# Altium project CRD25DA12N-FMC V2 (09-2024).PrjPcb (part 4 of 9)
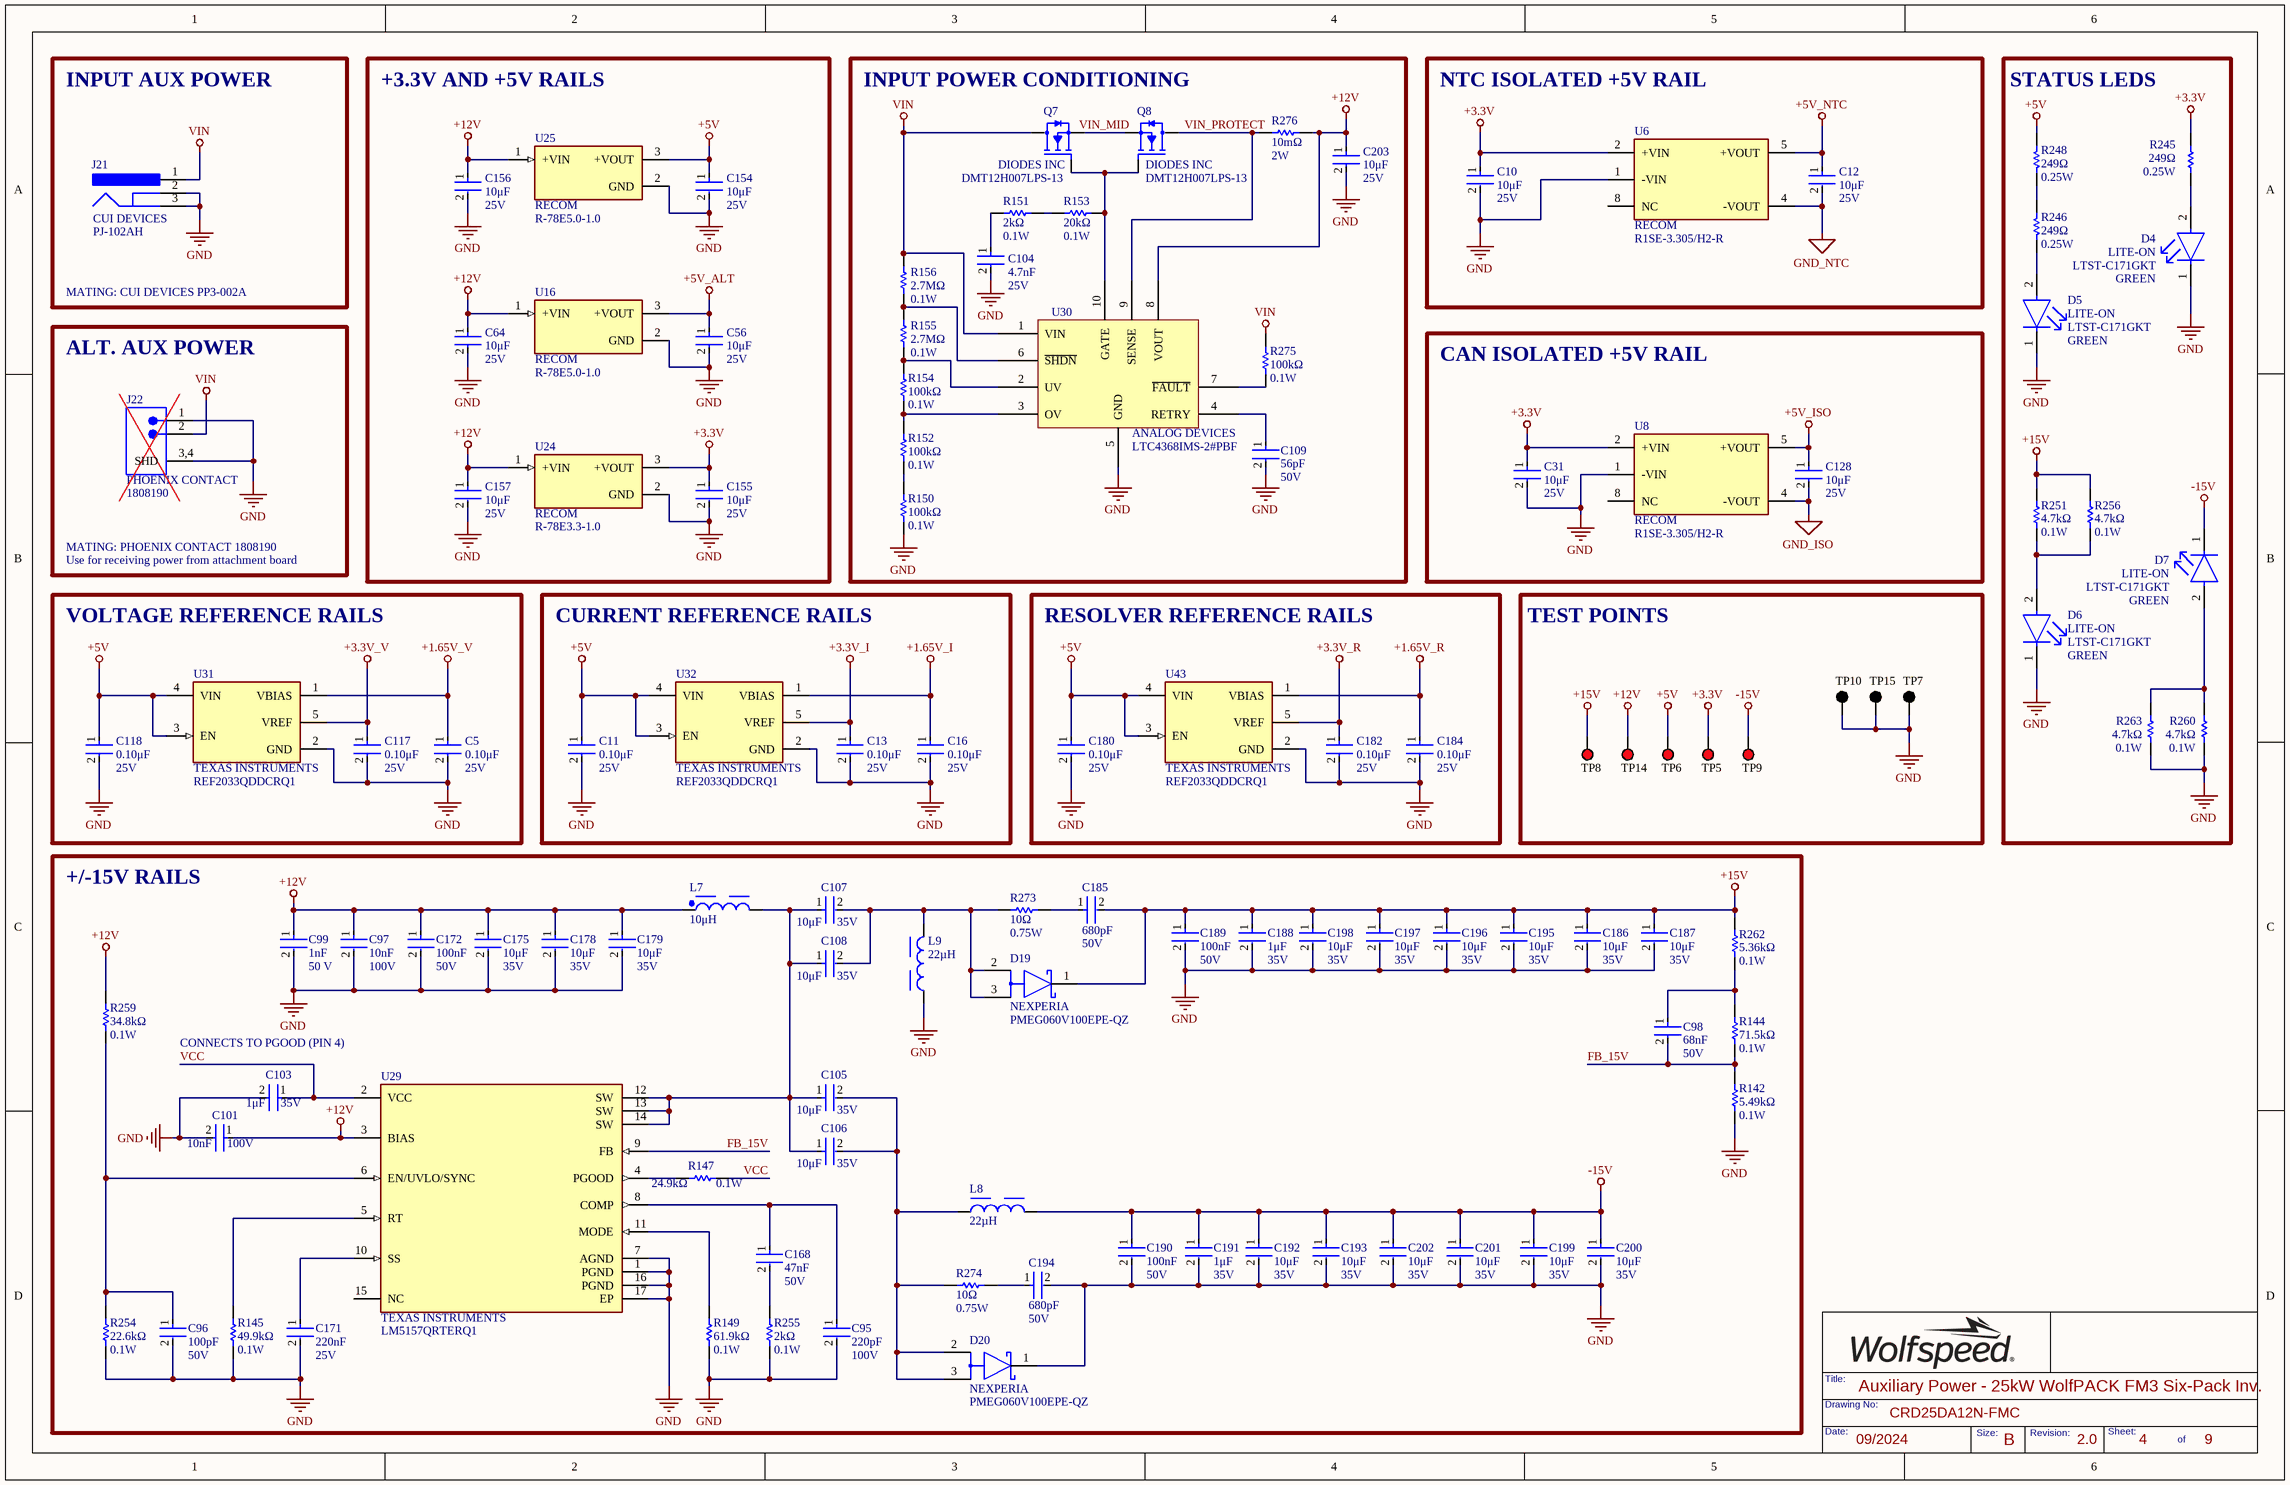
[diagram p10: 04 - Auxiliary Power.SchDoc]

## Sheet 04 - Auxiliary Power.SchDoc: Auxiliary Power - 25kW WolfPACK FM3 Six-Pack Inv. (continued)
### Library data of the parts
C5 C11 C13 C16 C117 C118 C180 C182 C184 = CMP-2006-03057-2: CAP CER 0.1UF 25V X7R 0603; Manufacturer: KEMET; Value: 0.10μF; Material: Ceramic; Tolerance: 0.1; Temperature Coefficient: 30ppm/°C; Automotive Grade: Grade 1; Lead Free: Yes; Device Class L3: Ceramic Capacitors; Manufacturer Part Number: C0603C104K3RACTU; Digikey Description: CAP CER 0.1UF 25V X7R 0603; Mouser Description: Multilayer Ceramic Capacitors MLCC - SMD/SMT 25volts 0.1uF X7R 10%; Package: 0603; Temperature Range Low: -55°C; Automotive: Yes; Device Class L2: Capacitors; Octopart: https://octopart.com/c0603c104k3ractu-kemet-127541; ComponentLink2Description: Datasheet; ComponentLink2URL: https://api.kemet.com/component-edge/download/datasheet/C0603C100J5GACAUTO.pdf; Temperature Range High: +125°C; RoHS: TRUE; Device Class L1: Passive Components; Category: Cap; Temperature: -55°C to +125°C; Height: 0.87mm; Temperature Characteristic: X7R
C10 C12 C31 C56 C64 C128 C154-C157 C203 = CMP-13271-001434-1: CAP CER 10UF 25V X7R 1206; Manufacturer: SAMSUNG; Tolerance: 10%; Value: 10μF; Max Operating Temperature: 125°C; Dielectric: X7R; Min Operating Temperature: -55°C; Height: 1.6mm; Mount: Surface Mount; Width: 0.063inch; Thickness: 0.071inch; Case Code (Metric): 3216; Contact Plating: Tin; Packaging: Tape and Reel; Package: 1206; Case Code (Imperial): 1206; Length: 0.126inch; Radiation Hardening: No; Package Quantity: 1; Depth: 1.6mm; Manufacturer Part Number: CL31B106KAHSFNE
C95 = GCM1885C2A221JA16D: CAP CER 220PF 100V C0G/NP0 0603; Manufacturer: MURATA; Material: 4241ConductorMaterial; Tolerance: 5%; Dielectric: C0G; Dissipation Factor: 0.01%; Temperature Coefficient: 30ppm/°C; Supplier 1: Mouser; Manufacturer Part Number: GCM1885C2A221JA16D; RoHS: Yes; Category: Ceramic Capacitors; Stock 1: 78175; Pricing 1: 1=0.11, 10=0.052, 50=0.052, 100=0.031, 1000=0.023, 10000=0.018 (USD); Mount: Surface Mount; Case/Package: 0603; Case Code (Metric): 1608; Case Code (Imperial): 0603; Min Operating Temperature: -55°C; Max Operating Temperature: 125°C; Capacitance: 220pF; Package Quantity: 1; Packaging: Tape and Reel; Voltage Rating (DC): 100V; Termination: SMD/SMT; Voltage: 100V; Series: GCM; Construction: Flat; Length: 1.6mm; Width: 0.031inch; Height: 0.8mm; Thickness: 0.035inch; Depth: 0.8mm; Ratings: AEC-Q200; Radiation Hardening: No; Lead Free: Lead Free; RoHS Compliant: Yes; ComponentLink1URL: https://datasheet.ciiva.com/133/product-133699.pdf?src-supplier=Digikey; ComponentLink1Description: https://datasheet.ciiva.com/133/product-133699.pdf?src-supplier=Digikey; ComponentLink2URL: https://datasheet.ciiva.com/133/product-133700.pdf?src-supplier=Digikey; ComponentLink2Description: https://datasheet.ciiva.com/133/product-133700.pdf?src-supplier=Digikey; ComponentLink3URL: https://datasheet.ciiva.com/133/product-133701.pdf?src-supplier=Digikey; ComponentLink3Description: https://datasheet.ciiva.com/133/product-133701.pdf?src-supplier=Digikey; ComponentLink4URL: https://datasheet.ciiva.com/11605/product-11605111.pdf?src-supplier=Avnet; ComponentLink4Description: https://datasheet.ciiva.com/11605/product-11605111.pdf?src-supplier=Avnet; ComponentLink5URL: https://datasheet.ciiva.com/16508/s0717e-16508220.pdf?src-supplier=Future+Electronics; ComponentLink5Description: https://datasheet.ciiva.com/16508/s0717e-16508220.pdf?src-supplier=Future+Electronics; Supplier Part Number 1: 81-GCM1885C2A221J16D; Package: 0603
C96 = CL10C101JB8NNNC: CAP CER 100PF 50V C0G/NP0 0603; Manufacturer: SAMSUNG; Material: Ceramic; Tolerance: 5%; Dielectric: C0G; Temperature Coefficient: 300ppm/°C; Supplier 1: Rs; Manufacturer Part Number: CL10C101JB8NNNC; RoHS: Yes; Category: Ceramic Capacitors; Stock 1: 488000; Mount: Surface Mount; Case Code (Metric): 1608; Case Code (Imperial): 0603; Contact Plating: Tin; Min Operating Temperature: -55°C; Max Operating Temperature: 125°C; Voltage Rating (DC): 50V; Packaging: Tape and Reel; Package Quantity: 1; Voltage Rating: 50V; Series: CL; Construction: Flat; Length: 1.6mm; Width: 0.031inch; Height: 0.8mm; Depth: 0.8mm; Thickness: 0.035inch; Radiation Hardening: No; Lead Free: Lead Free; RoHS Compliant: Yes; ComponentLink1URL: https://datasheet.ciiva.com/25782/cl10c101jb8nnnc-25782145.pdf?src-supplier=Digi-Key; ComponentLink1Description: https://datasheet.ciiva.com/25782/cl10c101jb8nnnc-25782145.pdf?src-supplier=Digi-Key; ComponentLink2URL: https://datasheet.ciiva.com/26838/getdatasheetpartid-358356-26838483.pdf?src-supplier=Verical; ComponentLink2Description: https://datasheet.ciiva.com/26838/getdatasheetpartid-358356-26838483.pdf?src-supplier=Verical; ComponentLink3URL: https://datasheet.ciiva.com/29199/456574-da-01-en-vs-kondensator-0603-29199002.pdf?src-supplier=Conrad; ComponentLink3Description: https://datasheet.ciiva.com/29199/456574-da-01-en-vs-kondensator-0603-29199002.pdf?src-supplier=Conrad; ComponentLink4URL: https://datasheet.ciiva.com/26310/mlcc-catalogdownload2013-eng-26310303.pdf?src-supplier=Distrelec; ComponentLink4Description: https://datasheet.ciiva.com/26310/mlcc-catalogdownload2013-eng-26310303.pdf?src-supplier=Distrelec; Supplier Part Number 1: 7665130; Package: 0603; Value: 100pF
C97 C101 = GCM188R72A103KA37D: CAP CER 10000PF 100V X7R 0603; Manufacturer: MURATA; Material: 4241ConductorMaterial; Tolerance: 10%; Supplier 1: Mouser; Manufacturer Part Number: GCM188R72A103KA37D; RoHS: Yes; Category: Ceramic Capacitors; Stock 1: 588517; Pricing 1: 1=0.1, 10=0.037, 50=0.037, 100=0.019, 1000=0.012, 4000=0.011, 8000=0.009, 10000=0.009, 24000=0.008, 100000=0.007 (USD); Mount: Surface Mount; Case/Package: 0603; Case Code (Imperial): 0603; Case Code (Metric): 1608; Min Operating Temperature: -55°C; Max Operating Temperature: 125°C; Capacitance: 10nF; Packaging: Tape and Reel; Voltage Rating (DC): 100V; Package Quantity: 1; Dielectric: X7R; Termination: SMD/SMT; Voltage: 100V; Series: GCM; Construction: Flat; Length: 1.6mm; Width: 0.031inch; Height: 0.8mm; Thickness: 0.035inch; Depth: 0.8mm; Ratings: AEC-Q200; Radiation Hardening: No; Reach SVHC Compliant: No; Lead Free: Lead Free; RoHS Compliant: Yes; ComponentLink1URL: https://datasheet.ciiva.com/132/product-132908.pdf?src-supplier=Digikey; ComponentLink1Description: https://datasheet.ciiva.com/132/product-132908.pdf?src-supplier=Digikey; ComponentLink2URL: https://datasheet.ciiva.com/132/product-132907.pdf?src-supplier=Digikey; ComponentLink2Description: https://datasheet.ciiva.com/132/product-132907.pdf?src-supplier=Digikey; ComponentLink3URL: https://datasheet.ciiva.com/132/product-132909.pdf?src-supplier=Digikey; ComponentLink3Description: https://datasheet.ciiva.com/132/product-132909.pdf?src-supplier=Digikey; ComponentLink4URL: https://datasheet.ciiva.com/11786/0900766b80ef92d0-11786108.pdf?src-supplier=Rs; ComponentLink4Description: https://datasheet.ciiva.com/11786/0900766b80ef92d0-11786108.pdf?src-supplier=Rs; ComponentLink5URL: https://datasheet.ciiva.com/16497/product-16497251.pdf?src-supplier=Future+Electronics; ComponentLink5Description: https://datasheet.ciiva.com/16497/product-16497251.pdf?src-supplier=Future+Electronics; ComponentLink6URL: https://datasheet.ciiva.com/18183/getdatasheetpartid-178890-18183651.pdf?src-supplier=Verical; ComponentLink6Description: https://datasheet.ciiva.com/18183/getdatasheetpartid-178890-18183651.pdf?src-supplier=Verical; ComponentLink7URL: https://datasheet.ciiva.com/11619/product-11619719.pdf?src-supplier=Avnet; ComponentLink7Description: https://datasheet.ciiva.com/11619/product-11619719.pdf?src-supplier=Avnet; Supplier Part Number 1: 81-GCM188R72A103KA7D; Package: 0603
C98 = CGA3E2X7R1H683K080AA: CAP CER 0.068UF 50V X7R 0603; Manufacturer: TDK; Tolerance: 10%; Supplier 1: Digikey; Manufacturer Part Number: CGA3E2X7R1H683K080AA; RoHS: Yes; Category: Ceramic Capacitors; Stock 1: 167422; Pricing 1: 1=0.11, 10=0.075, 50=0.0432, 100=0.0335, 500=0.02524, 1000=0.01983 (USD); Mount: Surface Mount; Case/Package: 0603; Case Code (Metric): 1608; Case Code (Imperial): 0603; Weight: 7.1E-05oz; Min Operating Temperature: -55°C; Max Operating Temperature: 125°C; Packaging: Tape and Reel; Capacitance: 68nF; Voltage Rating: 50V; Termination: SMD/SMT; Series: CGA; Package Quantity: 4000; Dielectric: X7R; Length: 1.6mm; Width: 0.8mm; Height: 0.8mm; Depth: 0.8mm; Ratings: AEC-Q200; RoHS Compliant: Yes; Reach SVHC Compliant: No; ComponentLink1URL: https://datasheet.ciiva.com/24219/cga3e2x7r1h683k080aa-265937-24219113.pdf?src-supplier=Mouser; ComponentLink1Description: https://datasheet.ciiva.com/24219/cga3e2x7r1h683k080aa-265937-24219113.pdf?src-supplier=Mouser; ComponentLink2URL: https://datasheet.ciiva.com/46424/1839935-46424229.pdf?src-supplier=Element14; ComponentLink2Description: https://datasheet.ciiva.com/46424/1839935-46424229.pdf?src-supplier=Element14; ComponentLink3URL: https://datasheet.ciiva.com/46424/1839935-46424230.pdf?src-supplier=Element14; ComponentLink3Description: https://datasheet.ciiva.com/46424/1839935-46424230.pdf?src-supplier=Element14; Supplier Part Number 1: 445-5665-1-ND; Package: 0603
C99 = CMP-2006-03716-2: CAP CER 1000PF 50V X7R 0603; Manufacturer: KEMET; Material: Ceramic; Automotive Grade: Grade 1; Value: 1nF; Tolerance: 0.1; Temperature Coefficient: 30ppm/°C; Category: Cap; Automotive: Yes; Temperature Range High: +125°C; Temperature Range Low: -55°C; Temperature Characteristic: X7R; Device Class L1: Passive Components; Height: 0.87mm; Lead Free: Yes; Package: 0603; Digikey Description: CAP CER 1000PF 50V X7R 0603; Manufacturer Part Number: C0603C102K5RACAUTO; ComponentLink2URL: https://api.kemet.com/component-edge/download/datasheet/C0603C100J5GACAUTO.pdf; Mouser Description: Multilayer Ceramic Capacitors MLCC - SMD/SMT 1000pF 50volts 10% X7R AUTO; RoHS: TRUE; Octopart: https://octopart.com/c0603c102k5racauto-kemet-18822673; Device Class L3: Ceramic Capacitors; ComponentLink2Description: Datasheet; Device Class L2: Capacitors; Temperature: -55°C to +125°C
C103 C188 C191 = CGA3E1X7R1V105K080AC: CAP CER 1UF 35V X7R 0603; Manufacturer: TDK; Material: 4241ConductorMaterial; Tolerance: 10%; Supplier 1: Avnet; Manufacturer Part Number: CGA3E1X7R1V105K080AC; RoHS: Yes; Category: Ceramic Capacitors; Stock 1: 4000; Pricing 1: 4000=0.042, 8000=0.04, 24000=0.039 (USD); Mount: Surface Mount; Case/Package: 0603; Case Code (Metric): 1608; Case Code (Imperial): 0603; Weight: 7.1E-05oz; Min Operating Temperature: -55°C; Max Operating Temperature: 125°C; Capacitance: 1μF; Packaging: Tape and Reel; Dielectric: X7R; Termination: SMD/SMT; Voltage Rating (DC): 35V; Package Quantity: 4000; Series: CGA; Length: 1.6mm; Width: 0.8mm; Height: 0.8mm; Ratings: AEC-Q200; RoHS Compliant: Yes; ComponentLink1URL: https://4donline.ihs.com/images/VipMasterIC/IC/TDKC/TDKC-S-A0003616427/TDKC-S-A0003616427-1.pdf?hkey=52A5661711E402568146F3353EA87419&src-supplier=Farnell; ComponentLink1Description: https://4donline.ihs.com/images/VipMasterIC/IC/TDKC/TDKC-S-A0003616427/TDKC-S-A0003616427-1.pdf?hkey=52A5661711E402568146F3353EA87419&src-supplier=Farnell; ComponentLink2URL: https://datasheet.octopart.com/CGA3E1X7R1V105K080AC-TDK-datasheet-136412745.pdf?src-supplier=Element14; ComponentLink2Description: https://datasheet.octopart.com/CGA3E1X7R1V105K080AC-TDK-datasheet-136412745.pdf?src-supplier=Element14; ComponentLink3URL: https://datasheet.octopart.com/CGA3E1X7R1V105K080AC-TDK-datasheet-43366117.pdf?src-supplier=Future+Electronics; ComponentLink3Description: https://datasheet.octopart.com/CGA3E1X7R1V105K080AC-TDK-datasheet-43366117.pdf?src-supplier=Future+Electronics; ComponentLink4URL: https://product.tdk.com/info/en/catalog/datasheets/mlcc_automotive_general_en.pdf?src-supplier=Digikey; ComponentLink4Description: https://product.tdk.com/info/en/catalog/datasheets/mlcc_automotive_general_en.pdf?src-supplier=Digikey; ComponentLink5URL: https://4donline.ihs.com/images/VipMasterIC/IC/TDKC/TDKC-S-A0003616427/TDKC-S-A0003616427-1.pdf?hkey=52A5661711E402568146F3353EA87419&src-supplier=Newark; ComponentLink5Description: https://4donline.ihs.com/images/VipMasterIC/IC/TDKC/TDKC-S-A0003616427/TDKC-S-A0003616427-1.pdf?hkey=52A5661711E402568146F3353EA87419&src-supplier=Newark; ComponentLink6URL: http://product.tdk.com/capacitor/mlcc/detailed_information.php?lang=en&ref=jp&part_no=CGA3E1X7R1V105K080AC&src-supplier=Mouser; ComponentLink6Description: http://product.tdk.com/capacitor/mlcc/detailed_information.php?lang=en&ref=jp&part_no=CGA3E1X7R1V105K080AC&src-supplier=Mouser; ComponentLink7URL: http://product.tdk.com/capacitor/mlcc/class/print_detail_pdf.php?lang=en&part_no=CGA3E1X7R1V105K080AC&src-supplier=Avnet; ComponentLink7Description: http://product.tdk.com/capacitor/mlcc/class/print_detail_pdf.php?lang=en&part_no=CGA3E1X7R1V105K080AC&src-supplier=Avnet; Supplier Part Number 1: 68AH9307; Package: 0603
C104 = C0603C472K3RAC7867: CAP CER 4700PF 25V 10% X7R 0603; Manufacturer: KEMET; Manufacturer Part Number: C0603C472K3RACTU; Dielectric Material: Ceramic; Value: 4.7nF; Supplier 1: Newark; RoHS: Yes; Category: Ceramic Capacitors; Stock 1: 8000; Pricing 1: 1=0.04800, 4000=0.04800 (USD); Mount: Surface Mount; Package: 0603; Case Code (Metric): 1608; Case Code (Imperial): 0603; Min Operating Temperature: -55°C; Max Operating Temperature: 125°C; Tolerance: 10%; Dielectric: X7R; Packaging: Tape and Reel; Package Quantity: 1; Voltage Rating (DC): 25V; Termination: SMD/SMT; Dissipation Factor: 10%; Series: C; Construction: Flat; Length: 1.6mm; Width: 0.031inch; Height: 0.8mm; Thickness: 0.034inch; Lead Pitch: 0.7mm; Depth: 0.8mm; Radiation Hardening: No; Reach SVHC Compliant: Yes; RoHS Compliant: Yes; ComponentLink1URL: https://datasheet.ciiva.com/5414/kem-c1002-x7r-smd-357932-5414293.pdf?src-supplier=Mouser; ComponentLink1Description: https://datasheet.ciiva.com/5414/kem-c1002-x7r-smd-357932-5414293.pdf?src-supplier=Mouser; Supplier Part Number 1: 67AH9250
C105-C108 C175 C178 C179 C186 C187 C192 C193 C195-C202 = GRM188R6YA106MA73D: CAP CER 10UF 35V X5R 0603; Manufacturer: MURATA; Material: 4241ConductorMaterial; Tolerance: 20%; Supplier 1: Mouser; Manufacturer Part Number: GRM188R6YA106MA73D; RoHS: Yes; Category: Ceramic Capacitors; Stock 1: 250689; Pricing 1: 1=0.31, 10=0.165, 50=0.165, 100=0.099, 1000=0.076, 4000=0.067, 8000=0.06, 10000=0.06, 24000=0.058, 100000=0.049 (USD); Mount: Surface Mount; Case/Package: 0603; Case Code (Metric): 1608; Case Code (Imperial): 0603; Min Operating Temperature: -55°C; Max Operating Temperature: 85°C; Packaging: Cut Tape; Capacitance: 10μF; Voltage Rating (DC): 35V; Dielectric: X5R; Series: GRM; Length: 0.063inch; Width: 0.031inch; Height: 1mm; Thickness: 0.039inch; RoHS Compliant: Yes; ComponentLink1URL: https://datasheet.octopart.com/GRM188R6YA106MA73D-Murata-datasheet-149523261.pdf?src-supplier=Newark; ComponentLink1Description: https://datasheet.octopart.com/GRM188R6YA106MA73D-Murata-datasheet-149523261.pdf?src-supplier=Newark; ComponentLink2URL: http://search.murata.co.jp/Ceramy/image/img/A01X/G101/ENG/GRM188R6YA106MA73-01.pdf?src-supplier=Future+Electronics; ComponentLink2Description: http://search.murata.co.jp/Ceramy/image/img/A01X/G101/ENG/GRM188R6YA106MA73-01.pdf?src-supplier=Future+Electronics; ComponentLink3URL: http://search.murata.co.jp/Ceramy/image/img/A01X/G101/ENG/GRM188R6YA106MA73-01.pdf?src-supplier=Digikey; ComponentLink3Description: http://search.murata.co.jp/Ceramy/image/img/A01X/G101/ENG/GRM188R6YA106MA73-01.pdf?src-supplier=Digikey; ComponentLink4URL: https://www.murata.com/~/media/webrenewal/support/library/catalog/products/capacitor/mlcc/c02e.ashx?la=en-us&src-supplier=Digikey; ComponentLink4Description: https://www.murata.com/~/media/webrenewal/support/library/catalog/products/capacitor/mlcc/c02e.ashx?la=en-us&src-supplier=Digikey; ComponentLink5URL: https://datasheet.octopart.com/GRM188R6YA106MA73D-Murata-datasheet-86813743.pdf?src-supplier=Future+Electronics; ComponentLink5Description: https://datasheet.octopart.com/GRM188R6YA106MA73D-Murata-datasheet-86813743.pdf?src-supplier=Future+Electronics; ComponentLink6URL: http://search.murata.co.jp/Ceramy/image/img/A01X/G101/ENG/GRM188R6YA106MA73-01.pdf?src-supplier=Mouser; ComponentLink6Description: http://search.murata.co.jp/Ceramy/image/img/A01X/G101/ENG/GRM188R6YA106MA73-01.pdf?src-supplier=Mouser; ComponentLink7URL: https://datasheet.octopart.com/GRM188R6YA106MA73D-Murata-datasheet-165579666.pdf?src-supplier=TME; ComponentLink7Description: https://datasheet.octopart.com/GRM188R6YA106MA73D-Murata-datasheet-165579666.pdf?src-supplier=TME; ComponentLink8URL: http://search.murata.co.jp/Ceramy/image/img/A01X/G101/ENG/GRM188R6YA106MA73-01.pdf?src-supplier=TTI; ComponentLink8Description: http://search.murata.co.jp/Ceramy/image/img/A01X/G101/ENG/GRM188R6YA106MA73-01.pdf?src-supplier=TTI; Supplier Part Number 1: 81-GRM188R6YA106MA3D; Package: 0603
C109 = CL10C560JB8NNNC: CAP CER 56PF 50V C0G/NP0 0603; Manufacturer: SAMSUNG; Material: Ceramic; Tolerance: 5%; Dielectric: C0G; Temperature Coefficient: 30ppm/°C; Supplier 1: Arrow Electronics; Manufacturer Part Number: CL10C560JB8NNNC; RoHS: Yes; Category: Ceramic Capacitors; Stock 1: 60182; Pricing 1: 1=0.05960, 10=0.01370, 25=0.01360, 100=0.01080, 250=0.01070, 500=0.00740, 1000=0.00590, 3000=0.00560, 6000=0.00530, 15000=0.00500, 30000=0.00470 (USD); Mount: Surface Mount; Case Code (Metric): 1608; Case Code (Imperial): 0603; Min Operating Temperature: -55°C; Max Operating Temperature: 125°C; Packaging: Tape and Reel; Package Quantity: 1; Voltage: 50V; Voltage Rating (DC): 50V; Series: CL; Construction: Flat; Termination: SMD/SMT; Length: 1.6mm; Width: 0.031inch; Height: 0.8mm; Thickness: 0.035inch; Depth: 0.8mm; Radiation Hardening: No; Lead Free: Lead Free; RoHS Compliant: Yes; ComponentLink1URL: https://datasheet.ciiva.com/25803/cl10c560jb8nnnc-25803592.pdf?src-supplier=Digi-Key; ComponentLink1Description: https://datasheet.ciiva.com/25803/cl10c560jb8nnnc-25803592.pdf?src-supplier=Digi-Key; ComponentLink2URL: https://datasheet.ciiva.com/26838/getdatasheetpartid-640760-26838546.pdf?src-supplier=Verical; ComponentLink2Description: https://datasheet.ciiva.com/26838/getdatasheetpartid-640760-26838546.pdf?src-supplier=Verical; ComponentLink3URL: https://datasheet.ciiva.com/29198/456837-da-01-en-vs-kondensator-0603-29198873.pdf?src-supplier=Conrad; ComponentLink3Description: https://datasheet.ciiva.com/29198/456837-da-01-en-vs-kondensator-0603-29198873.pdf?src-supplier=Conrad; ComponentLink4URL: https://datasheet.ciiva.com/48428/mlcc-catalogdownload2013-eng-48428598.pdf?src-supplier=Distrelec; ComponentLink4Description: https://datasheet.ciiva.com/48428/mlcc-catalogdownload2013-eng-48428598.pdf?src-supplier=Distrelec; ComponentLink5URL: https://datasheet.ciiva.com/16449/cl05b104kq5nnnc-16449527.pdf?src-supplier=Future+Electronics; ComponentLink5Description: https://datasheet.ciiva.com/16449/cl05b104kq5nnnc-16449527.pdf?src-supplier=Future+Electronics; Supplier Part Number 1: CL10C560JB8NNNC; Package: 0603; Value: 56pF
C168 = CGA3E2X7R1H473K080AA: CAP CER 0.047UF 50V X7R 0603; Manufacturer: TDK; Material: 4241ConductorMaterial; Tolerance: 10%; Supplier 1: Avnet; Manufacturer Part Number: CGA3E2X7R1H473K080AA; RoHS: Yes; Category: Ceramic Capacitors; Stock 1: 19753; Pricing 1: 1=0.098, 25=0.063, 50=0.045, 100=0.027 (USD); Mount: Surface Mount; Case/Package: 0603; Case Code (Metric): 1608; Case Code (Imperial): 0603; Weight: 7.1E-05oz; Min Operating Temperature: -55°C; Max Operating Temperature: 125°C; Capacitance: 47nF; Packaging: Tape and Reel; Termination: SMD/SMT; Series: CGA; Package Quantity: 1; Voltage Rating (DC): 50V; Dielectric: X7R; Length: 1.6mm; Width: 0.031inch; Height: 0.8mm; Thickness: 0.035inch; Depth: 0.8mm; Ratings: AEC-Q200; Lead Free: Lead Free; RoHS Compliant: Yes; Reach SVHC Compliant: No; ComponentLink1URL: https://datasheet.ciiva.com/24217/cga3e2x7r1h473k080aa-266154-24217548.pdf?src-supplier=Mouser; ComponentLink1Description: https://datasheet.ciiva.com/24217/cga3e2x7r1h473k080aa-266154-24217548.pdf?src-supplier=Mouser; Supplier Part Number 1: 80X3178; Package: 0603
C171 = GCM188R71E224KA55D: CAP CER 0.22UF 25V X7R 0603; Manufacturer: MURATA; Material: 4241ConductorMaterial; Tolerance: 10%; Value: 220nF; Supplier 1: Mouser; Manufacturer Part Number: GCM188R71E224KA55D; RoHS: Yes; Category: Ceramic Capacitors; Stock 1: 1572028; Pricing 1: 1=0.1, 10=0.052, 50=0.052, 100=0.027, 1000=0.017, 4000=0.012, 8000=0.01, 10000=0.01, 100000=0.009 (USD); Mount: Surface Mount; Case/Package: 0603; Case Code (Metric): 1608; Case Code (Imperial): 0603; Min Operating Temperature: -55°C; Max Operating Temperature: 125°C; Package Quantity: 1; Voltage Rating: 25V; Packaging: Tape and Reel; Dielectric: X7R; Termination: SMD/SMT; Series: GCM; Construction: Flat; Length: 1.6mm; Width: 0.031inch; Height: 0.8mm; Thickness: 0.035inch; Depth: 0.8mm; Ratings: AEC-Q200; Radiation Hardening: No; Lead Free: Lead Free; RoHS Compliant: Yes; ComponentLink1URL: https://datasheet.ciiva.com/18183/getdatasheetpartid-223900-18183612.pdf?src-supplier=Verical; ComponentLink1Description: https://datasheet.ciiva.com/18183/getdatasheetpartid-223900-18183612.pdf?src-supplier=Verical; ComponentLink2URL: https://datasheet.ciiva.com/16202/product-16202362.pdf?src-supplier=Future+Electronics; ComponentLink2Description: https://datasheet.ciiva.com/16202/product-16202362.pdf?src-supplier=Future+Electronics; ComponentLink3URL: https://datasheet.ciiva.com/134/product-134757.pdf?src-supplier=Digikey; ComponentLink3Description: https://datasheet.ciiva.com/134/product-134757.pdf?src-supplier=Digikey; Supplier Part Number 1: 81-GCM188R71E224K55D; Voltage Rating (DC): 25V; Package: 0603
C172 C189 C190 = CGA3E2X7R1H104K080AA: CAP CER 0.1UF 50V X7R 0603; Manufacturer: TDK; Material: 4241ConductorMaterial; Tolerance: 10%; Supplier 1: Avnet; Manufacturer Part Number: CGA3E2X7R1H104K080AA; RoHS: Yes; Category: Ceramic Capacitors; Stock 1: 168000; Pricing 1: 4000=0.01068, 8000=0.01044, 16000=0.0102, 24000=0.00996, 32000=0.00972 (USD); Mount: Surface Mount; Case/Package: 0603; Case Code (Imperial): 0603; Case Code (Metric): 1608; Weight: 7.1E-05oz; Min Operating Temperature: -55°C; Max Operating Temperature: 125°C; Capacitance: 100nF; Packaging: Tape and Reel; Dielectric: X7R; Voltage Rating (DC): 50V; Package Quantity: 1; Voltage Rating: 50V; Termination: SMD/SMT; Series: CGA; Length: 1.6mm; Width: 0.031inch; Height: 0.8mm; Depth: 0.8mm; Thickness: 0.035inch; Ratings: AEC-Q200; Radiation Hardening: No; RoHS Compliant: Yes; Lead Free: 5697LeadFree; Reach SVHC Compliant: No; ComponentLink1URL: https://datasheet.ciiva.com/24216/cga3e2x7r1h104k080aa-266291-24216208.pdf?src-supplier=Mouser; ComponentLink1Description: https://datasheet.ciiva.com/24216/cga3e2x7r1h104k080aa-266291-24216208.pdf?src-supplier=Mouser; ComponentLink2URL: https://datasheet.ciiva.com/15192/getdatasheetpartid-715867-15192412.pdf?src-supplier=Verical; ComponentLink2Description: https://datasheet.ciiva.com/15192/getdatasheetpartid-715867-15192412.pdf?src-supplier=Verical; ComponentLink3URL: https://datasheet.ciiva.com/23803/1936565-23803084.pdf?src-supplier=Newark; ComponentLink3Description: https://datasheet.ciiva.com/23803/1936565-23803084.pdf?src-supplier=Newark; ComponentLink4URL: https://datasheet.ciiva.com/22725/1735392-22725642.pdf?src-supplier=Element14; ComponentLink4Description: https://datasheet.ciiva.com/22725/1735392-22725642.pdf?src-supplier=Element14; ComponentLink5URL: https://datasheet.ciiva.com/46385/1735392-46385708.pdf?src-supplier=Element14; ComponentLink5Description: https://datasheet.ciiva.com/46385/1735392-46385708.pdf?src-supplier=Element14; ComponentLink6URL: https://datasheet.ciiva.com/16500/mlccspec-automotive-general-midvoltage-en-16500693.pdf?src-supplier=Future+Electronics; ComponentLink6Description: https://datasheet.ciiva.com/16500/mlccspec-automotive-general-midvoltage-en-16500693.pdf?src-supplier=Future+Electronics; Supplier Part Number 1: CGA3E2X7R1H104K080AA; Package: 0603
C185 C194 = C0603C681J5GACTU: CAP CER 680PF 50V C0G/NP0 0603; Manufacturer: KEMET; Dielectric Material: Ceramic; Material: 4241ConductorMaterial; Tolerance: 5%; Dielectric: C0G; Temperature Coefficient: 30ppm/°C; Dissipation Factor: 0.1%; Supplier 1: Mouser; Manufacturer Part Number: C0603C681J5GACTU; RoHS: Yes; Category: Ceramic Capacitors; Stock 1: 42665; Pricing 1: 1=0.1, 10=0.042, 50=0.042, 100=0.025, 1000=0.02, 4000=0.015, 8000=0.013, 10000=0.013, 100000=0.009 (USD); Mount: Surface Mount,PCB; Case/Package: 0603; Number of Pins: 2; Case Code (Imperial): 0603; Case Code (Metric): 1608; Min Operating Temperature: -55°C; Max Operating Temperature: 125°C; Capacitance: 680pF; Package Quantity: 4000; Voltage Rating: 50V; Packaging: Tape and Reel; Voltage Rating (DC): 50V; Termination: SMD/SMT; Series: C; Construction: Flat; Voltage Rating (AC): 50V; Length: 1.6mm; Width: 0.8mm; Height: 0.8mm; Lead Pitch: 0.7mm; Thickness: 0.034inch; Depth: 0.8mm; Radiation Hardening: No; Reach SVHC Compliant: No; RoHS Compliant: Yes; Lead Free: 5697LeadFree; ComponentLink1URL: https://datasheet.ciiva.com/144/docfinderpartnumber-c0603c681j5gactu-144808.pdf?src-supplier=Digikey; ComponentLink1Description: https://datasheet.ciiva.com/144/docfinderpartnumber-c0603c681j5gactu-144808.pdf?src-supplier=Digikey; ComponentLink2URL: https://datasheet.ciiva.com/7823/40889-7823834.pdf?src-supplier=Element14; ComponentLink2Description: https://datasheet.ciiva.com/7823/40889-7823834.pdf?src-supplier=Element14; ComponentLink3URL: https://datasheet.ciiva.com/7823/40889-7823833.pdf?src-supplier=Element14; ComponentLink3Description: https://datasheet.ciiva.com/7823/40889-7823833.pdf?src-supplier=Element14; ComponentLink4URL: https://datasheet.ciiva.com/28535/1372242-28535863.pdf?src-supplier=Element14; ComponentLink4Description: https://datasheet.ciiva.com/28535/1372242-28535863.pdf?src-supplier=Element14; ComponentLink5URL: https://datasheet.ciiva.com/14600/70095383-14600026.pdf?src-supplier=Allied+Electronics; ComponentLink5Description: https://datasheet.ciiva.com/14600/70095383-14600026.pdf?src-supplier=Allied+Electronics; Supplier Part Number 1: 80-C0603C681J5G; Package: 0603
D4-D7 = CMP-22017-000007-1: LED GREEN CLEAR CHIP SMD; Luminous Intensity: 12mcd; Lens Color: Colorless; Dominant Wavelength: 569nm; Number of LEDs: 1; Power Dissipation: 100mW; Viewing Angle: 130°; Reverse Voltage: 5V; Test Current: 10mA; Forward Voltage: 2.1V; Wavelength: 585nm; Lens Style: Diffused; Forward Current: 30mA; Height: 0.8mm; Mount: Surface Mount; Package Quantity: 1; Length: 2mm; Case Code (Metric): 2012; Number of Pins: 2; Number of Elements: 1; Packaging: Tape and Reel; Color: GREEN; Min Operating Temperature: -55°C; Case/Package: 0805; Power Rating: 100mW; Max Operating Temperature: 85°C; Radiation Hardening: No; Depth: 1.25mm; Lens Transparency: Clear; Width: 1.25mm; Lead Free: Lead Free; Case Code (Imperial): 0805; Illumination Color: Green; Manufacturer Part Number: LTST-C171GKT; Package: 0805
D19 D20 = PMEG060V100EPE-QZ: DIODE SCHOTTKY 60V 10A CFP15B; Supplier 1: Avnet; RoHS: No; Category: Uncategorized; Stock 1: 5000; Pricing 1: 5000=0.30592, 10000=0.29765, 20000=0.28938, 30000=0.28111, 40000=0.27284, 50000=0.26458, 500000=0.25631 (USD); Value: N/A; Case/Package: TO-277; Supplier Part Number 1: PMEG060V100EPE-QZ; Manufacturer Part Number: PMEG060V100EPE-QZ; Package: TO-277
J21 = PJ-102AH: CONN PWR JACK 2X5.5MM SOLDER; Gender: Male; Shielding: Unshielded; Current Rating: 5A; Voltage Rating: 24V; Insulation Resistance: 50MR; Number of Conductors: 2; Supplier 1: Arrow Electronics; Manufacturer: CUI DEVICES; Manufacturer Part Number: PJ-102AH; RoHS: Yes; Category: Uncategorized; Mount: Through Hole; Color: Black; Contact Material: Copper; Contact Plating: Nickel; Housing Color: Black; Housing Material: Thermoplastic; Min Operating Temperature: -25°C; Max Operating Temperature: 85°C; Package Quantity: 280; Termination: Through Hole; Connector Type: Jack; Contact Gender: Male; Series: -; Orientation: Horizontal; Packaging: Bulk; Diameter: 2.1mm; Flammability Rating: UL94 V-0; Lead Free: Lead Free; RoHS Compliant: Yes; ComponentLink1URL: http://www.mouser.com/ds/2/670/PJ-102AH-524179.pdf?src-supplier=Mouser; ComponentLink1Description: http://www.mouser.com/ds/2/670/PJ-102AH-524179.pdf?src-supplier=Mouser; ComponentLink2URL: https://www.cui.com/product/resource/digikeypdf/pj-102ah.pdf?src-supplier=Digi-Key; ComponentLink2Description: https://www.cui.com/product/resource/digikeypdf/pj-102ah.pdf?src-supplier=Digi-Key; ComponentLink3URL: http://www.cui.com/Product/Resource/FuturePDF/PJ-102AH.pdf?src-supplier=Future+Electronics; ComponentLink3Description: http://www.cui.com/Product/Resource/FuturePDF/PJ-102AH.pdf?src-supplier=Future+Electronics; Supplier Part Number 1: PJ-102AH; Value: N/A; Package: N/A
J22 = 1808190: TERM BLOCK HDR 2POS 90DEG 2.5MM; Manufacturer Part Number: 1808190; Value: N/A; Package: N/A
L7 = 74439358100: FIXED IND 10UH 5.8A 20 MOHM SMD; Manufacturer: WURTH ELECTRONIK; Manufacturer Part Number: 74439358100; Case/Package: N/A; Package: N/A
L8 L9 = 74437368220: FIXED IND 22UH 3.5A 74 MOHM SMD; NexarPartId: 57062130; Manufacturer: WURTH ELECTRONIK; Tolerance: 20%; Series Resistance: 74mΩ; Saturation Current: 5A; DC Resistance (DCR): 64mΩ; Self Resonant Frequency: 7MHz; Test Frequency: 100kHz; RoHS: Compliant; Inductance Tolerance: 20%; Width: 10mm; Min Operating Temperature: -40°C; Ambient Temperature Range High: 85°C; Ambient Temperature Range Low: -40°C; Height: 3.8mm; Length: 11mm; Inductance: 22µH; Max Operating Temperature: 125°C; RMS Current (Irms): 3.5A; Manufacturer Part Number: 74437368220; Package: N/A
Q7 Q8 = DMT12H007LPS-13: MOSFET N-CH 120V 90A PWRDI5060-8; Supplier 1: Newark; Manufacturer Part Number: DMT12H007LPS-13; RoHS: Yes; Category: MOSFETs; Stock 1: 2500; Pricing 1: 1=1.79000, 10=1.60000, 25=1.49000, 50=1.37000, 100=1.25000, 250=1.14000, 500=1.03000, 1000=0.81500 (USD); RoHS Compliant: Yes; Supplier Part Number 1: 68AH9585; Value: N/A; Package: 8-PowerTDFN
R142 = RC0603FR-075K49L: RES 5.49K OHM 1% 1/10W 0603; Manufacturer: YAGEO; Temperature Coefficient: 100ppm/°C; Voltage Rating: 50V; Max Power Dissipation: 100mW; Supplier 1: Future Electronics; Manufacturer Part Number: RC0603FR-075K49L; RoHS: Yes; Category: Chip SMD Resistors; Stock 1: 1425000; Pricing 1: 5000=0.0015, 50000=0.0014, 150000=0.0014, 375000=0.0013, 1000000=0.0012 (USD); Case/Package: 0603; Case Code (Imperial): 0603; Case Code (Metric): 1608; Size Code: 0603; Min Operating Temperature: -55°C; Max Operating Temperature: 155°C; Tolerance: 1%; Packaging: Tape and Reel; Resistance: 5.49kΩ; Series: RC; Number of Terminations: 2; Termination: SMD/SMT; Package Quantity: 5000; Voltage Rating (DC): 50V; Features: Moisture Resistant; Length: 1.6mm; Width: 0.8mm; Height: 0.45mm; RoHS Compliant: Yes; Lead Free: 5697LeadFree; ComponentLink1URL: https://datasheet.ciiva.com/2454/pyu-r-int-thick-7-2454378.pdf?src-supplier=Digikey; ComponentLink1Description: https://datasheet.ciiva.com/2454/pyu-r-int-thick-7-2454378.pdf?src-supplier=Digikey; ComponentLink2URL: https://datasheet.ciiva.com/2454/pyu-r-int-thick-7-2454379.pdf?src-supplier=Digikey; ComponentLink2Description: https://datasheet.ciiva.com/2454/pyu-r-int-thick-7-2454379.pdf?src-supplier=Digikey; ComponentLink3URL: https://datasheet.ciiva.com/2454/pyu-r-int-thick-7-2454380.pdf?src-supplier=Digikey; ComponentLink3Description: https://datasheet.ciiva.com/2454/pyu-r-int-thick-7-2454380.pdf?src-supplier=Digikey; ComponentLink4URL: https://datasheet.ciiva.com/12558/rc0603-272842-12558872.pdf?src-supplier=Mouser; ComponentLink4Description: https://datasheet.ciiva.com/12558/rc0603-272842-12558872.pdf?src-supplier=Mouser; Supplier Part Number 1: 1172345; Package: 0603
R144 = RT0603DRE0771K5L: RES SMD 71.5KOHM 0.5% 1/10W 0603; Manufacturer: YAGEO; Temperature Coefficient: 50ppm/°C; Voltage Rating (DC): 50V; Supplier 1: Future Electronics; Manufacturer Part Number: RT0603DRE0771K5L; RoHS: Yes; Category: Chip SMD Resistors; Stock 1: 25000; Pricing 1: 5000=0.0103, 20000=0.0097, 75000=0.0093, 150000=0.0091, 375000=0.0086 (USD); Case/Package: 0603; Case Code (Metric): 1608; Case Code (Imperial): 0603; Min Operating Temperature: -55°C; Max Operating Temperature: 155°C; Packaging: Cut Tape; Resistance: 71.5kΩ; Tolerance: 0.5%; Series: RT; Number of Terminations: 2; Package Quantity: 5000; Features: Moisture Resistant; Length: 0.063inch; Width: 0.031inch; Height: 0.022inch; RoHS Compliant: Yes; Lead Free: Lead Free; ComponentLink1URL: https://datasheet.ciiva.com/2566/pyu-rt-1-to-0-05-rohs-l-5-2566380.pdf?src-supplier=Digikey; ComponentLink1Description: https://datasheet.ciiva.com/2566/pyu-rt-1-to-0-05-rohs-l-5-2566380.pdf?src-supplier=Digikey; Supplier Part Number 1: 3077636; Package: 0603
R145 = RT0603FRE0749K9L: RES SMD 49.9K OHM 1% 1/10W 0603; Manufacturer: YAGEO; Temperature Coefficient: 50ppm/°C; Max Power Dissipation: 100mW; Voltage Rating: 75V; Voltage Rating (DC): 50V; Supplier 1: Future Electronics; Manufacturer Part Number: RT0603FRE0749K9L; RoHS: Yes; Category: Chip SMD Resistors; Pricing 1: 5000=0.0034, 20000=0.0032, 100000=0.003, 200000=0.0029, 625000=0.0027 (USD); Case/Package: 0603; Case Code (Imperial): 0603; Case Code (Metric): 1608; Contact Plating: Tin,Matte; Min Operating Temperature: -55°C; Max Operating Temperature: 125°C; Resistance: 49.9kΩ; Tolerance: 1%; Packaging: Tape and Reel; Series: RT; Number of Terminations: 2; Termination: SMD/SMT; Width: 800um; RoHS Compliant: Yes; Lead Free: Lead Free; ComponentLink1URL: https://datasheet.ciiva.com/12704/pyu-rt-1-to-0-05-rohs-l-4-12704159.pdf?src-supplier=Mouser; ComponentLink1Description: https://datasheet.ciiva.com/12704/pyu-rt-1-to-0-05-rohs-l-4-12704159.pdf?src-supplier=Mouser; Stock 1: 5000; Supplier Part Number 1: 3100550; Package: 0603
R147 = RC0603FR-0724K9L: RES 24.9K OHM 1% 1/10W 0603; Manufacturer: YAGEO; Temperature Coefficient: 100ppm/°C; Max Power Dissipation: 100mW; Voltage Rating: 50V; Supplier 1: Future Electronics; Manufacturer Part Number: RC0603FR-0724K9L; RoHS: Yes; Category: Chip SMD Resistors; Stock 1: 1145000; Pricing 1: 5000=0.0017, 50000=0.0016, 150000=0.0015, 375000=0.0014, 1000000=0.0013 (USD); Package: 0603; Case Code (Imperial): 0603; Case Code (Metric): 1608; Size Code: 0603; Min Operating Temperature: -55°C; Max Operating Temperature: 155°C; Resistance: 24.9kΩ; Tolerance: 1%; Packaging: Tape and Reel; Series: RC; Number of Terminations: 2; Package Quantity: 1; Voltage Rating (DC): 50V; Termination: SMD/SMT; Features: Moisture Resistant; Construction: Rectangular; Length: 0.063inch; Width: 0.031inch; Height: 0.022inch; Depth: 0.8mm; RoHS Compliant: Yes; Lead Free: Lead Free; Military Standard: Not; ComponentLink1URL: https://datasheet.ciiva.com/2453/pyu-r-int-thick-7-2453985.pdf?src-supplier=Digikey; ComponentLink1Description: https://datasheet.ciiva.com/2453/pyu-r-int-thick-7-2453985.pdf?src-supplier=Digikey; ComponentLink2URL: https://datasheet.ciiva.com/2453/pyu-r-int-thick-7-2453986.pdf?src-supplier=Digikey; ComponentLink2Description: https://datasheet.ciiva.com/2453/pyu-r-int-thick-7-2453986.pdf?src-supplier=Digikey; ComponentLink3URL: https://datasheet.ciiva.com/2453/pyu-r-int-thick-7-2453987.pdf?src-supplier=Digikey; ComponentLink3Description: https://datasheet.ciiva.com/2453/pyu-r-int-thick-7-2453987.pdf?src-supplier=Digikey; ComponentLink4URL: https://datasheet.ciiva.com/15189/getdatasheetpartid-327910-15189670.pdf?src-supplier=Verical; ComponentLink4Description: https://datasheet.ciiva.com/15189/getdatasheetpartid-327910-15189670.pdf?src-supplier=Verical; Supplier Part Number 1: 3435880
R149 = RC0603FR-0761K9L: RES 61.9K OHM 1% 1/10W 0603; Manufacturer: YAGEO; Temperature Coefficient: 100ppm/°C; Max Power Dissipation: 100mW; Voltage Rating (DC): 50V; Working Voltage: 75V; Supplier 1: Future Electronics; Manufacturer Part Number: RC0603FR-0761K9L; RoHS: Yes; Category: Chip SMD Resistors; Stock 1: 410000; Pricing 1: 5000=0.0015, 75000=0.0014, 200000=0.0013, 500000=0.0013, 1250000=0.0012 (USD); Case/Package: 0603; Case Code (Imperial): 0603; Case Code (Metric): 1608; Min Operating Temperature: -55°C; Max Operating Temperature: 155°C; Packaging: Tape and Reel; Resistance: 61.9kΩ; Tolerance: 1%; Series: RC; Number of Terminations: 2; Package Quantity: 5000; Voltage Rating: 50V; Termination: SMD/SMT; Features: Moisture Resistant; Construction: Rectangular; Technology: THICK FILM; Length: 1.6mm; Width: 0.8mm; Height: 0.45mm; Depth: 0.8mm; RoHS Compliant: Yes; Lead Free: Lead Free; Military Standard: Not; ComponentLink1URL: https://datasheet.ciiva.com/12558/rc0603-272842-12558637.pdf?src-supplier=Mouser; ComponentLink1Description: https://datasheet.ciiva.com/12558/rc0603-272842-12558637.pdf?src-supplier=Mouser; Supplier Part Number 1: 9857970; Package: 0603
R150 R152 R154 R275 = RC0603FR-07100KL: RES 100K OHM 1% 1/10W 0603; Manufacturer: YAGEO; Temperature Coefficient: 100ppm/°C; Voltage Rating: 50V; Working Voltage: 75V; Max Power Dissipation: 100mW; Value: 100kΩ; Supplier 1: Future Electronics; Manufacturer Part Number: RC0603FR-07100KL; RoHS: Yes; Category: Chip SMD Resistors; Stock 1: 39805000; Pricing 1: 5000=0.00150, 50000=0.00140, 200000=0.00140, 625000=0.00130, 2000000=0.00120 (USD); Package: 0603; Number of Pins: 2; Case Code (Imperial): 0603; Case Code (Metric): 1608; Min Operating Temperature: -55°C; Max Operating Temperature: 155°C; Tolerance: 1%; Resistor Type: Thick Film; Voltage Rating (DC): 50V; Packaging: Tape and Reel; Termination: SMD/SMT; Number of Terminations: 2; Features: Moisture Resistant; Series: RC; Resistance Tolerance: 1%; Construction: Rectangular; Technology: THICK FILM; Length: 1.6mm; Width: 0.8mm; Height: 0.45mm; Depth: 0.8mm; Reach SVHC Compliant: Yes; Military Standard: Not; Lead Free: Lead Free; RoHS Compliant: Yes; ComponentLink1URL: https://datasheet.ciiva.com/11808/0900766b80f96399-11808107.pdf?src-supplier=Rs; ComponentLink1Description: https://datasheet.ciiva.com/11808/0900766b80f96399-11808107.pdf?src-supplier=Rs; ComponentLink2URL: https://datasheet.ciiva.com/7983/443971-7983593.pdf?src-supplier=Element14; ComponentLink2Description: https://datasheet.ciiva.com/7983/443971-7983593.pdf?src-supplier=Element14; ComponentLink3URL: https://datasheet.ciiva.com/22747/443971-22747516.pdf?src-supplier=Element14; ComponentLink3Description: https://datasheet.ciiva.com/22747/443971-22747516.pdf?src-supplier=Element14; ComponentLink4URL: https://datasheet.ciiva.com/46440/1868787-46440889.pdf?src-supplier=Element14; ComponentLink4Description: https://datasheet.ciiva.com/46440/1868787-46440889.pdf?src-supplier=Element14; ComponentLink5URL: https://datasheet.ciiva.com/7746/1738695-7746235.pdf?src-supplier=Element14; ComponentLink5Description: https://datasheet.ciiva.com/7746/1738695-7746235.pdf?src-supplier=Element14; ComponentLink6URL: https://datasheet.ciiva.com/7746/1738695-7746234.pdf?src-supplier=Element14; ComponentLink6Description: https://datasheet.ciiva.com/7746/1738695-7746234.pdf?src-supplier=Element14; Supplier Part Number 1: 3697448
R151 R255 = RT0603DRE072KL: RES SMD 2K OHM 0.5% 1/10W 0603; Manufacturer: YAGEO; Temperature Coefficient: 50ppm/°C; Voltage Rating: 75V; Max Power Dissipation: 100mW; Voltage Rating (DC): 50V; Value: 2kΩ; Supplier 1: Future Electronics; Manufacturer Part Number: RT0603DRE072KL; RoHS: Yes; Category: Chip SMD Resistors; Stock 1: 5000; Pricing 1: 5000=0.00650, 20000=0.00620, 75000=0.00590, 125000=0.00580, 250000=0.00550 (USD); Package: 0603; Contact Plating: Tin,Matte; Case Code (Metric): 1608; Case Code (Imperial): 0603; Min Operating Temperature: -55°C; Max Operating Temperature: 125°C; Tolerance: 0.5%; Resistor Type: Thin Film; Packaging: Tape and Reel; Package Quantity: 5000; Number of Terminations: 2; Termination: SMD/SMT; Features: Moisture Resistant; Series: RT; Construction: Rectangular; Length: 0.063inch; Width: 0.031inch; Height: 0.022inch; Depth: 0.8mm; Radiation Hardening: No; Military Standard: Not; Lead Free: Lead Free; RoHS Compliant: Yes; ComponentLink1URL: https://datasheet.ciiva.com/2566/pyu-rt-1-to-0-05-rohs-l-5-2566187.pdf?src-supplier=Digi-Key; ComponentLink1Description: https://datasheet.ciiva.com/2566/pyu-rt-1-to-0-05-rohs-l-5-2566187.pdf?src-supplier=Digi-Key; ComponentLink2URL: https://datasheet.ciiva.com/12705/pyu-rt-1-to-0-05-rohs-l-4-12705391.pdf?src-supplier=Mouser; ComponentLink2Description: https://datasheet.ciiva.com/12705/pyu-rt-1-to-0-05-rohs-l-4-12705391.pdf?src-supplier=Mouser; Supplier Part Number 1: 6165116
R153 = CRCW060320K0FKTA: RES SMD 20K OHM 1% 1/10W 0603; Manufacturer: VISHAY DALE; Temperature Coefficient: 100ppm/°C; Voltage Rating: 75V; Max Power Dissipation: 100mW; Value: 20kΩ; Supplier 1: Arrow Electronics; Manufacturer Part Number: CRCW060320K0FKTA; RoHS: No; Category: Chip SMD Resistors; Stock 1: 8; Pricing 1: 1=0.14090 (USD); Package: 0603; Number of Pins: 2; Contact Plating: Tin,Lead; Weight: 7.1E-05oz; Case Code (Metric): 1608; Case Code (Imperial): 0603; Min Operating Temperature: -55°C; Max Operating Temperature: 155°C; Tolerance: 1%; Resistor Type: Thick Film; Package Quantity: 5000; Packaging: Tape and Reel; Number of Terminations: 2; Termination: SMD/SMT; Power Dissipation: 100mW; Voltage Rating (DC): 75V; Features: Automotive AEC-Q200; Series: CRCW; Construction: Rectangular; Resistance Tolerance: 1%; Length: 1.55mm; Width: 0.033inch; Height: 0.02inch; Depth: 0.85mm; Radiation Hardening: No; Lead Free: Contains Lead; Military Standard: Not; RoHS Compliant: No; ComponentLink1URL: https://datasheet.ciiva.com/3883/dcrcw-3883254.pdf?src-supplier=Arrow+Electronics; ComponentLink1Description: https://datasheet.ciiva.com/3883/dcrcw-3883254.pdf?src-supplier=Arrow+Electronics; ComponentLink2URL: https://datasheet.ciiva.com/26933/getdatasheetpartid-28850-26933811.pdf?src-supplier=Verical; ComponentLink2Description: https://datasheet.ciiva.com/26933/getdatasheetpartid-28850-26933811.pdf?src-supplier=Verical; ComponentLink3URL: https://datasheet.ciiva.com/9033/dcrcw-9033436.pdf?src-supplier=Avnet; ComponentLink3Description: https://datasheet.ciiva.com/9033/dcrcw-9033436.pdf?src-supplier=Avnet; ComponentLink4URL: https://datasheet.ciiva.com/2565/dcrcw-2565123.pdf?src-supplier=Digi-Key; ComponentLink4Description: https://datasheet.ciiva.com/2565/dcrcw-2565123.pdf?src-supplier=Digi-Key; Supplier Part Number 1: CRCW060320K0FKTA
R155 R156 = RC0603JR-072M7L: RES 2.7M OHM 5% 1/10W 0603; Manufacturer: YAGEO; Temperature Coefficient: 100ppm/°C; Voltage Rating: 75V; Max Power Dissipation: 100mW; Voltage Rating (DC): 50V; Value: 2.7MΩ; Supplier 1: Arrow Electronics; Manufacturer Part Number: RC0603JR-072M7L; RoHS: Yes; Category: Chip SMD Resistors; Stock 1: 12804; Pricing 1: 1=0.04340, 10=0.00650, 100=0.00220, 500=0.00210, 1000=0.00140, 3000=0.00110, 6000=0.00090 (USD); Package: 0603; Contact Plating: Tin,Matte; Case Code (Imperial): 0603; Case Code (Metric): 1608; Weight: 7.1E-05oz; Size Code: 0603; Min Operating Temperature: -55°C; Max Operating Temperature: 155°C; Tolerance: 5%; Resistor Type: Thick Film; Packaging: Tape and Reel; Package Quantity: 1; Termination: SMD/SMT; Number of Terminations: 2; Features: Moisture Resistant; Series: RC; Construction: Rectangular; Length: 1.6mm; Width: 0.8mm; Height: 0.022inch; Depth: 0.8mm; Radiation Hardening: No; Military Standard: Not; Lead Free: Lead Free; RoHS Compliant: Yes; ComponentLink1URL: https://datasheet.ciiva.com/2453/pyu-r-int-thick-7-2453209.pdf?src-supplier=Digi-Key; ComponentLink1Description: https://datasheet.ciiva.com/2453/pyu-r-int-thick-7-2453209.pdf?src-supplier=Digi-Key; ComponentLink2URL: https://datasheet.ciiva.com/2453/pyu-r-int-thick-7-2453210.pdf?src-supplier=Digi-Key; ComponentLink2Description: https://datasheet.ciiva.com/2453/pyu-r-int-thick-7-2453210.pdf?src-supplier=Digi-Key; ComponentLink3URL: https://datasheet.ciiva.com/2453/pyu-r-int-thick-7-2453208.pdf?src-supplier=Digi-Key; ComponentLink3Description: https://datasheet.ciiva.com/2453/pyu-r-int-thick-7-2453208.pdf?src-supplier=Digi-Key; Supplier Part Number 1: RC0603JR-072M7L
R245 R246 R248 = RC1206FR-07249RL: RES 249 OHM 1% 1/4W 1206; Manufacturer: YAGEO; Voltage Rating: 200V; Temperature Coefficient: 100ppm/°C; Max Power Dissipation: 250mW; Value: 249Ω; Supplier 1: Future Electronics; Manufacturer Part Number: RC1206FR-07249RL; RoHS: Yes; Category: Chip SMD Resistors; Stock 1: 560000; Pricing 1: 5000=0.00430, 25000=0.00410, 100000=0.00390, 250000=0.00370, 625000=0.00350 (USD); Package: 1206; Case Code (Imperial): 1206; Case Code (Metric): 3216; Size Code: 1206; Min Operating Temperature: -55°C; Max Operating Temperature: 155°C; Tolerance: 1%; Packaging: Tape and Reel; Termination: SMD/SMT; Resistor Type: Thick Film; Voltage Rating (DC): 200V; Features: Moisture Resistant; Series: RC; Number of Terminations: 2; Construction: Rectangular; Length: 3.1mm; Depth: 1.6mm; Military Standard: Not; Lead Free: Lead Free; RoHS Compliant: Yes; ComponentLink1URL: https://datasheet.ciiva.com/16747/pyu-rc1206-51-rohs-l-4-16747103.pdf?src-supplier=Future+Electronics; ComponentLink1Description: https://datasheet.ciiva.com/16747/pyu-rc1206-51-rohs-l-4-16747103.pdf?src-supplier=Future+Electronics; Supplier Part Number 1: 1142064
R251 R256 R260 R263 = CRCW06034K70FKTA: RES SMD 4.7K OHM 1% 1/10W 0603; Manufacturer: VISHAY DALE; Voltage Rating: 75V; Max Power Dissipation: 100mW; Temperature Coefficient: 100ppm/°C; Value: 4.7kΩ; Supplier 1: Digi-Key; Manufacturer Part Number: CRCW06034K70FKTA; RoHS: No; Category: Chip SMD Resistors; Pricing 1: 1=0.15000, 10=0.12900, 100=0.05040, 1000=0.02111, 2500=0.01936 (USD); Package: 0603; Weight: 7.1E-05oz; Case Code (Metric): 1608; Case Code (Imperial): 0603; Contact Plating: Tin,Lead; Min Operating Temperature: -55°C; Max Operating Temperature: 155°C; Tolerance: 1%; Resistor Type: Thick Film; Package Quantity: 5000; Packaging: Tape and Reel; Number of Terminations: 2; Voltage Rating (DC): 75V; Power Dissipation: 100mW; Features: Automotive AEC-Q200; Series: CRCW; Construction: Rectangular; Length: 1.55mm; Width: 0.033inch; Height: 0.02inch; Depth: 0.85mm; Radiation Hardening: No; Lead Free: Contains Lead; Military Standard: Not; RoHS Compliant: No; ComponentLink1URL: https://datasheet.ciiva.com/9071/dcrcw-9071351.pdf?src-supplier=Avnet; ComponentLink1Description: https://datasheet.ciiva.com/9071/dcrcw-9071351.pdf?src-supplier=Avnet; ComponentLink2URL: https://datasheet.ciiva.com/2565/dcrcw-2565426.pdf?src-supplier=Digi-Key; ComponentLink2Description: https://datasheet.ciiva.com/2565/dcrcw-2565426.pdf?src-supplier=Digi-Key; Supplier Part Number 1: 541-3004-6-ND
R254 = RT0603DRE0722K6L: RES SMD 22.6KOHM 0.5% 1/10W 0603; Manufacturer: YAGEO; Temperature Coefficient: 50ppm/°C; Voltage Rating (DC): 50V; Supplier 1: Digikey; Manufacturer Part Number: RT0603DRE0722K6L; RoHS: Yes; Category: Chip SMD Resistors; Stock 1: 2223; Pricing 1: 1=0.1, 10=0.037, 50=0.0306, 100=0.0279, 500=0.02208, 1000=0.01979 (USD); Case/Package: 0603; Case Code (Imperial): 0603; Case Code (Metric): 1608; Min Operating Temperature: -55°C; Max Operating Temperature: 155°C; Packaging: Cut Tape; Resistance: 22.6kΩ; Tolerance: 0.5%; Series: RT; Number of Terminations: 2; Package Quantity: 5000; Features: Moisture Resistant; Length: 0.063inch; Width: 0.031inch; Height: 0.022inch; RoHS Compliant: Yes; Lead Free: Lead Free; ComponentLink1URL: https://datasheet.ciiva.com/2566/pyu-rt-1-to-0-05-rohs-l-5-2566111.pdf?src-supplier=Digikey; ComponentLink1Description: https://datasheet.ciiva.com/2566/pyu-rt-1-to-0-05-rohs-l-5-2566111.pdf?src-supplier=Digikey; Supplier Part Number 1: 311-2487-1-ND; Package: 0603
R259 = RT0603DRE0734K8L: RES SMD 34.8KOHM 0.5% 1/10W 0603; Manufacturer: YAGEO; Temperature Coefficient: 50ppm/°C; Voltage Rating: 75V; Voltage Rating (DC): 50V; Max Power Dissipation: 100mW; Supplier 1: Digikey; Manufacturer Part Number: RT0603DRE0734K8L; RoHS: Yes; Category: Chip SMD Resistors; Stock 1: 8785; Pricing 1: 1=0.1, 10=0.037, 50=0.0306, 100=0.0279, 500=0.02208, 1000=0.01979 (USD); Case/Package: 0603; Case Code (Metric): 1608; Case Code (Imperial): 0603; Min Operating Temperature: -55°C; Max Operating Temperature: 155°C; Resistance: 34.8kΩ; Tolerance: 0.5%; Packaging: Tape and Reel; Series: RT; Termination: SMD/SMT; Number of Terminations: 2; Package Quantity: 5000; Length: 0.063inch; Width: 0.031inch; Height: 0.022inch; RoHS Compliant: Yes; Lead Free: Lead Free; ComponentLink1URL: https://datasheet.ciiva.com/2566/pyu-rt-1-to-0-05-rohs-l-5-2566218.pdf?src-supplier=Digikey; ComponentLink1Description: https://datasheet.ciiva.com/2566/pyu-rt-1-to-0-05-rohs-l-5-2566218.pdf?src-supplier=Digikey; Supplier Part Number 1: 311-2545-1-ND; Package: 0603